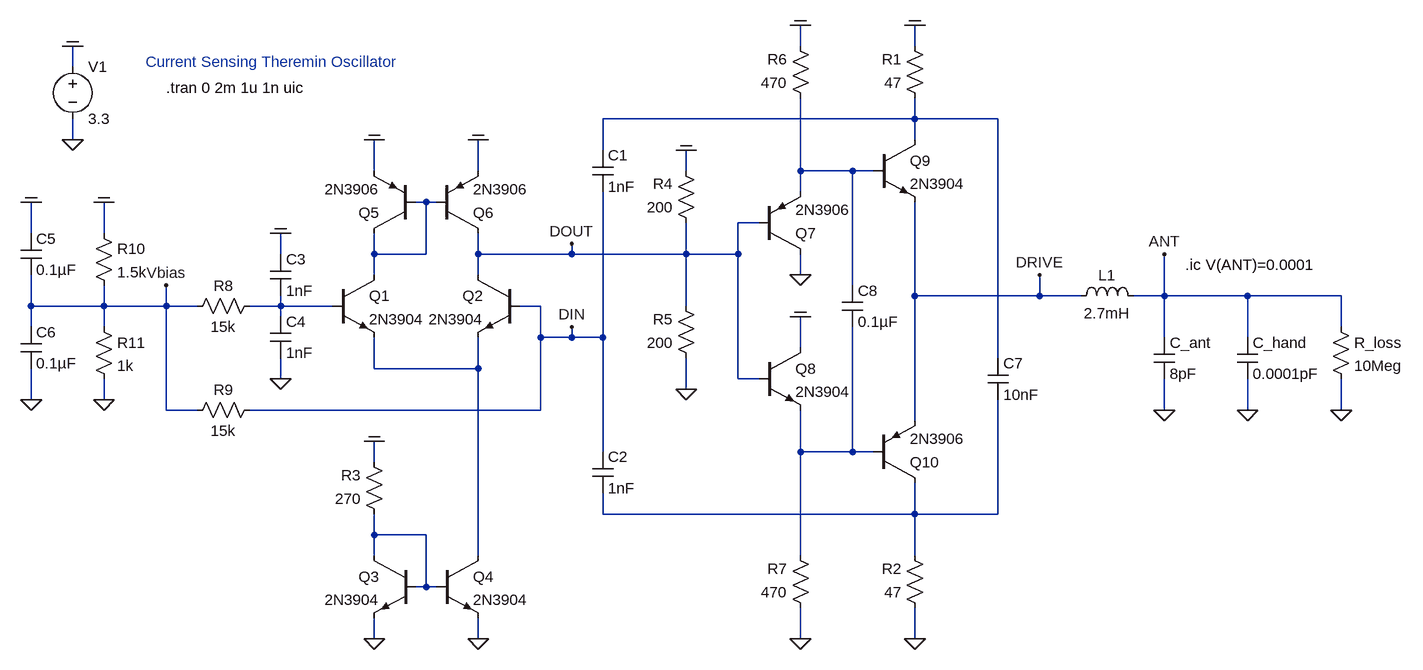
[diagram p0: schematic 2023_03_wallin_oscillator_bjt_power_rails_diff_amp_4bjt_buffer_v01.asc]
2023_03_wallin_oscillator_bjt_power_rails_diff_amp_4bjt_buffer_v01.asc, the LTspice schematic file:
Version 4
SHEET 1 16292 13396
WIRE 7312 7744 7312 7712
WIRE 7488 7744 7488 7712
WIRE 6192 7776 6192 7744
WIRE 7488 7856 7488 7824
WIRE 7488 7856 7008 7856
WIRE 7616 7856 7488 7856
WIRE 6192 7888 6192 7856
WIRE 7488 7888 7488 7856
WIRE 7008 7904 7008 7856
WIRE 6656 7936 6656 7888
WIRE 6816 7936 6816 7888
WIRE 7136 7936 7136 7904
WIRE 7312 7936 7312 7824
WIRE 7392 7936 7312 7936
WIRE 7424 7936 7392 7936
WIRE 7312 7968 7312 7936
WIRE 6736 7984 6720 7984
WIRE 6752 7984 6736 7984
WIRE 7248 8016 7216 8016
WIRE 6128 8032 6128 7984
WIRE 6240 8032 6240 7984
WIRE 6512 8064 6512 8032
WIRE 6656 8064 6656 8032
WIRE 6736 8064 6736 7984
WIRE 6736 8064 6656 8064
WIRE 6816 8064 6816 8032
WIRE 6960 8064 6960 8048
WIRE 6960 8064 6816 8064
WIRE 7136 8064 7136 8016
WIRE 7136 8064 6960 8064
WIRE 7216 8064 7216 8016
WIRE 7216 8064 7136 8064
WIRE 6656 8096 6656 8064
WIRE 6816 8096 6816 8064
WIRE 7312 8096 7312 8064
WIRE 7392 8112 7392 7936
WIRE 7488 8128 7488 7984
WIRE 7680 8128 7680 8096
WIRE 7680 8128 7488 8128
WIRE 7744 8128 7680 8128
WIRE 7872 8128 7872 8064
WIRE 7872 8128 7824 8128
WIRE 8000 8128 7872 8128
WIRE 8144 8128 8000 8128
WIRE 6128 8144 6128 8096
WIRE 6240 8144 6240 8112
WIRE 6240 8144 6128 8144
WIRE 6336 8144 6336 8112
WIRE 6336 8144 6240 8144
WIRE 6384 8144 6336 8144
WIRE 6512 8144 6512 8128
WIRE 6512 8144 6464 8144
WIRE 6592 8144 6512 8144
WIRE 6912 8144 6880 8144
WIRE 7136 8144 7136 8064
WIRE 6512 8160 6512 8144
WIRE 6128 8176 6128 8144
WIRE 6240 8176 6240 8144
WIRE 8144 8176 8144 8128
WIRE 6912 8192 6912 8144
WIRE 6960 8192 6960 8176
WIRE 6960 8192 6912 8192
WIRE 7008 8192 7008 7968
WIRE 7008 8192 6960 8192
WIRE 7872 8192 7872 8128
WIRE 8000 8192 8000 8128
WIRE 7312 8208 7312 8160
WIRE 7616 8224 7616 7856
WIRE 6656 8240 6656 8192
WIRE 6816 8240 6816 8192
WIRE 6816 8240 6656 8240
WIRE 6512 8256 6512 8224
WIRE 7216 8256 7216 8064
WIRE 7248 8256 7216 8256
WIRE 7136 8272 7136 8224
WIRE 6128 8288 6128 8240
WIRE 6240 8288 6240 8256
WIRE 6336 8304 6336 8144
WIRE 6384 8304 6336 8304
WIRE 6912 8304 6912 8192
WIRE 6912 8304 6464 8304
WIRE 7872 8304 7872 8256
WIRE 8000 8304 8000 8256
WIRE 8144 8304 8144 8256
WIRE 7488 8320 7488 8128
WIRE 7008 8368 7008 8192
WIRE 7312 8368 7312 8304
WIRE 7392 8368 7392 8176
WIRE 7392 8368 7312 8368
WIRE 7424 8368 7392 8368
WIRE 6656 8384 6656 8352
WIRE 7008 8464 7008 8432
WIRE 7488 8464 7488 8416
WIRE 7488 8464 7008 8464
WIRE 7616 8464 7616 8288
WIRE 7616 8464 7488 8464
WIRE 6656 8496 6656 8464
WIRE 6736 8496 6656 8496
WIRE 6656 8528 6656 8496
WIRE 6816 8528 6816 8240
WIRE 7312 8528 7312 8368
WIRE 7488 8528 7488 8464
WIRE 6736 8576 6736 8496
WIRE 6736 8576 6720 8576
WIRE 6752 8576 6736 8576
WIRE 6656 8656 6656 8624
WIRE 6816 8656 6816 8624
WIRE 7312 8656 7312 8608
WIRE 7488 8656 7488 8608
FLAG 6192 7888 0
FLAG 6192 7744 COM
FLAG 6816 8656 0
FLAG 6656 8656 0
FLAG 6656 8352 COM
FLAG 6512 8032 COM
FLAG 6512 8256 0
FLAG 6240 8288 0
FLAG 6240 7984 COM
FLAG 6128 8288 0
FLAG 6128 7984 COM
FLAG 7872 8304 0
FLAG 7872 8064 ANT
FLAG 8000 8304 0
FLAG 8144 8304 0
FLAG 7488 7712 COM
FLAG 7488 8656 0
FLAG 7312 8096 0
FLAG 7312 8160 COM
FLAG 6336 8112 Vbias
FLAG 7312 8656 0
FLAG 7312 7712 COM
FLAG 7680 8096 DRIVE
FLAG 6656 7888 COM
FLAG 6816 7888 COM
FLAG 7136 7904 COM
FLAG 7136 8272 0
FLAG 6960 8048 DOUT
FLAG 6960 8176 DIN
SYMBOL voltage 6192 7760 R0
WINDOW 123 0 0 Left 0
WINDOW 39 0 0 Left 0
SYMATTR InstName V1
SYMATTR Value 3.3
SYMBOL npn 6592 8096 R0
SYMATTR InstName Q1
SYMATTR Value 2N3904
SYMBOL npn 6880 8096 M0
SYMATTR InstName Q2
SYMATTR Value 2N3904
SYMBOL npn 6752 8528 R0
SYMATTR InstName Q4
SYMATTR Value 2N3904
SYMBOL npn 6720 8528 M0
SYMATTR InstName Q3
SYMATTR Value 2N3904
SYMBOL res 6672 8480 R180
WINDOW 0 36 76 Left 2
WINDOW 3 36 40 Left 2
SYMATTR InstName R3
SYMATTR Value 270
SYMBOL cap 6496 8064 R0
SYMATTR InstName C3
SYMATTR Value 1nF
SYMBOL cap 6496 8160 R0
SYMATTR InstName C4
SYMATTR Value 1nF
SYMBOL res 6224 8160 R0
WINDOW 0 36 40 Left 2
WINDOW 3 36 76 Left 2
SYMATTR InstName R11
SYMATTR Value 1k
SYMBOL res 6224 8016 R0
WINDOW 0 36 40 Left 2
WINDOW 3 36 76 Left 2
SYMATTR InstName R10
SYMATTR Value 1.5k
SYMBOL res 6368 8160 R270
WINDOW 0 32 56 VTop 2
WINDOW 3 0 56 VBottom 2
SYMATTR InstName R8
SYMATTR Value 15k
SYMBOL res 6368 8320 R270
WINDOW 0 32 56 VTop 2
WINDOW 3 0 56 VBottom 2
SYMATTR InstName R9
SYMATTR Value 15k
SYMBOL cap 6112 8176 R0
SYMATTR InstName C6
SYMATTR Value 0.1µF
SYMBOL cap 6112 8032 R0
SYMATTR InstName C5
SYMATTR Value 0.1µF
SYMBOL cap 7856 8192 R0
SYMATTR InstName C_ant
SYMATTR Value 8pF
SYMBOL cap 7984 8192 R0
SYMATTR InstName C_hand
SYMATTR Value 0.0001pF
SYMBOL res 8128 8160 R0
WINDOW 0 36 40 Left 2
WINDOW 3 36 76 Left 2
SYMATTR InstName R_loss
SYMATTR Value 10Meg
SYMBOL ind 7728 8144 R270
WINDOW 0 32 56 VTop 2
WINDOW 3 5 56 VBottom 2
SYMATTR InstName L1
SYMATTR Value 2.7mH
SYMATTR SpiceLine Ipk=0.5 Rser=120 Cpar=1.1pF
SYMBOL npn 7248 8208 R0
SYMATTR InstName Q8
SYMATTR Value 2N3904
SYMBOL pnp 7248 8064 M180
SYMATTR InstName Q7
SYMATTR Value 2N3906
SYMBOL res 7328 8624 R180
WINDOW 0 36 76 Left 2
WINDOW 3 36 40 Left 2
SYMATTR InstName R7
SYMATTR Value 470
SYMBOL res 7328 7840 R180
WINDOW 0 36 76 Left 2
WINDOW 3 36 40 Left 2
SYMATTR InstName R6
SYMATTR Value 470
SYMBOL npn 7424 7888 R0
SYMATTR InstName Q9
SYMATTR Value 2N3904
SYMBOL pnp 7424 8416 M180
SYMATTR InstName Q10
SYMATTR Value 2N3906
SYMBOL res 7504 7840 R180
WINDOW 0 36 76 Left 2
WINDOW 3 36 40 Left 2
SYMATTR InstName R1
SYMATTR Value 47
SYMBOL res 7504 8624 R180
WINDOW 0 36 76 Left 2
WINDOW 3 36 40 Left 2
SYMATTR InstName R2
SYMATTR Value 47
SYMBOL cap 6992 7904 R0
SYMATTR InstName C1
SYMATTR Value 1nF
SYMBOL cap 6992 8368 R0
SYMATTR InstName C2
SYMATTR Value 1nF
SYMBOL pnp 6752 8032 M180
SYMATTR InstName Q6
SYMATTR Value 2N3906
SYMBOL pnp 6720 8032 R180
SYMATTR InstName Q5
SYMATTR Value 2N3906
SYMBOL res 7152 8032 R180
WINDOW 0 36 76 Left 2
WINDOW 3 36 40 Left 2
SYMATTR InstName R4
SYMATTR Value 200
SYMBOL res 7152 8240 R180
WINDOW 0 36 76 Left 2
WINDOW 3 36 40 Left 2
SYMATTR InstName R5
SYMATTR Value 200
SYMBOL cap 7600 8224 R0
SYMATTR InstName C7
SYMATTR Value 10nF
SYMBOL cap 7376 8112 R0
SYMATTR InstName C8
SYMATTR Value 0.1µF
TEXT 6336 7808 Left 2 !.tran 0 2m 1u 1n uic
TEXT 6304 7768 Left 2 ;Current Sensing Theremin Oscillator
TEXT 7904 8080 Left 2 !.ic V(ANT)=0.0001

The netlist it stands for:
* 2023_03_wallin_oscillator_bjt_power_rails_diff_amp_4bjt_buffer_v01.asc
V1 COM 0 3.3
Q1 N003 N004 N005 0 2N3904
Q2 DOUT DIN N005 0 2N3904
Q4 N005 N008 0 0 2N3904
Q3 N008 N008 0 0 2N3904
R3 N008 COM 270
C3 COM N004 1nF
C4 N004 0 1nF
R11 Vbias 0 1k
R10 COM Vbias 1.5k
R8 Vbias N004 15k
R9 Vbias DIN 15k
C6 Vbias 0 0.1µF
C5 COM Vbias 0.1µF
C_ant ANT 0 8pF
C_hand ANT 0 0.0001pF
R_loss ANT 0 10Meg
L1 DRIVE ANT 2.7mH Ipk=0.5 Rser=120 Cpar=1.1pF
Q8 COM DOUT N006 0 2N3904
Q7 0 DOUT N002 0 2N3906
R7 0 N006 470
R6 N002 COM 470
Q9 N001 N002 DRIVE 0 2N3904
Q10 N007 N006 DRIVE 0 2N3906
R1 N001 COM 47
R2 0 N007 47
C1 N001 DIN 1nF
C2 DIN N007 1nF
Q6 DOUT N003 COM 0 2N3906
Q5 N003 N003 COM 0 2N3906
R4 DOUT COM 200
R5 0 DOUT 200
C7 N001 N007 10nF
C8 N002 N006 0.1µF
.model NPN NPN
.model PNP PNP
.lib standard.bjt
.tran 0 2m 1u 1n uic
* Current Sensing Theremin Oscillator
.ic V(ANT)=0.0001
.backanno
.end